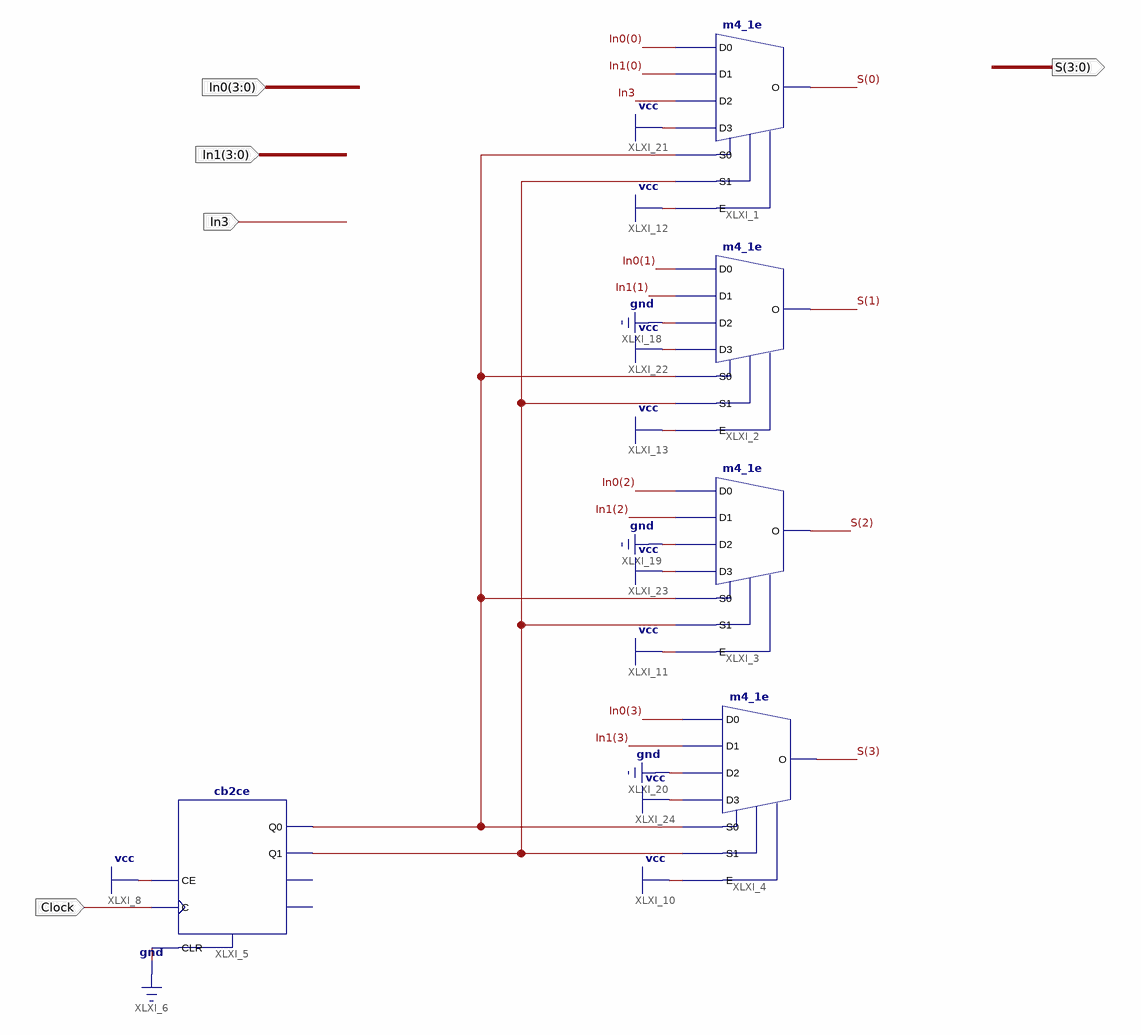
[diagram p0: schematic sheet 1]
// Xilinx ISE schematic Mux16.sch (spartan6) as structural Verilog: 5 symbols, 5 ports
module Mux16 (
  input  [3:0] In0,
  input  [3:0] In1,
  input  In3,
  input  Clock,
  output [3:0] S
);

  wire XLXN_42, XLXN_43;

  m4_1e XLXI_1 (.D0(In0[0]), .D1(In1[0]), .D2(In3), .D3(1'b1), .E(1'b1), .S0(XLXN_43), .S1(XLXN_42), .O(S[0]));
  m4_1e XLXI_2 (.D0(In0[1]), .D1(In1[1]), .D2(1'b0), .D3(1'b1), .E(1'b1), .S0(XLXN_43), .S1(XLXN_42), .O(S[1]));
  m4_1e XLXI_3 (.D0(In0[2]), .D1(In1[2]), .D2(1'b0), .D3(1'b1), .E(1'b1), .S0(XLXN_43), .S1(XLXN_42), .O(S[2]));
  m4_1e XLXI_4 (.D0(In0[3]), .D1(In1[3]), .D2(1'b0), .D3(1'b1), .E(1'b1), .S0(XLXN_43), .S1(XLXN_42), .O(S[3]));
  cb2ce XLXI_5 (.C(Clock), .CE(1'b1), .CLR(1'b0), .Q0(XLXN_43), .Q1(XLXN_42));  // open: CEO, TC
endmodule
